# EAGLE design Rauchmelder_v3.9.1 (EAGLE 9.6.2)
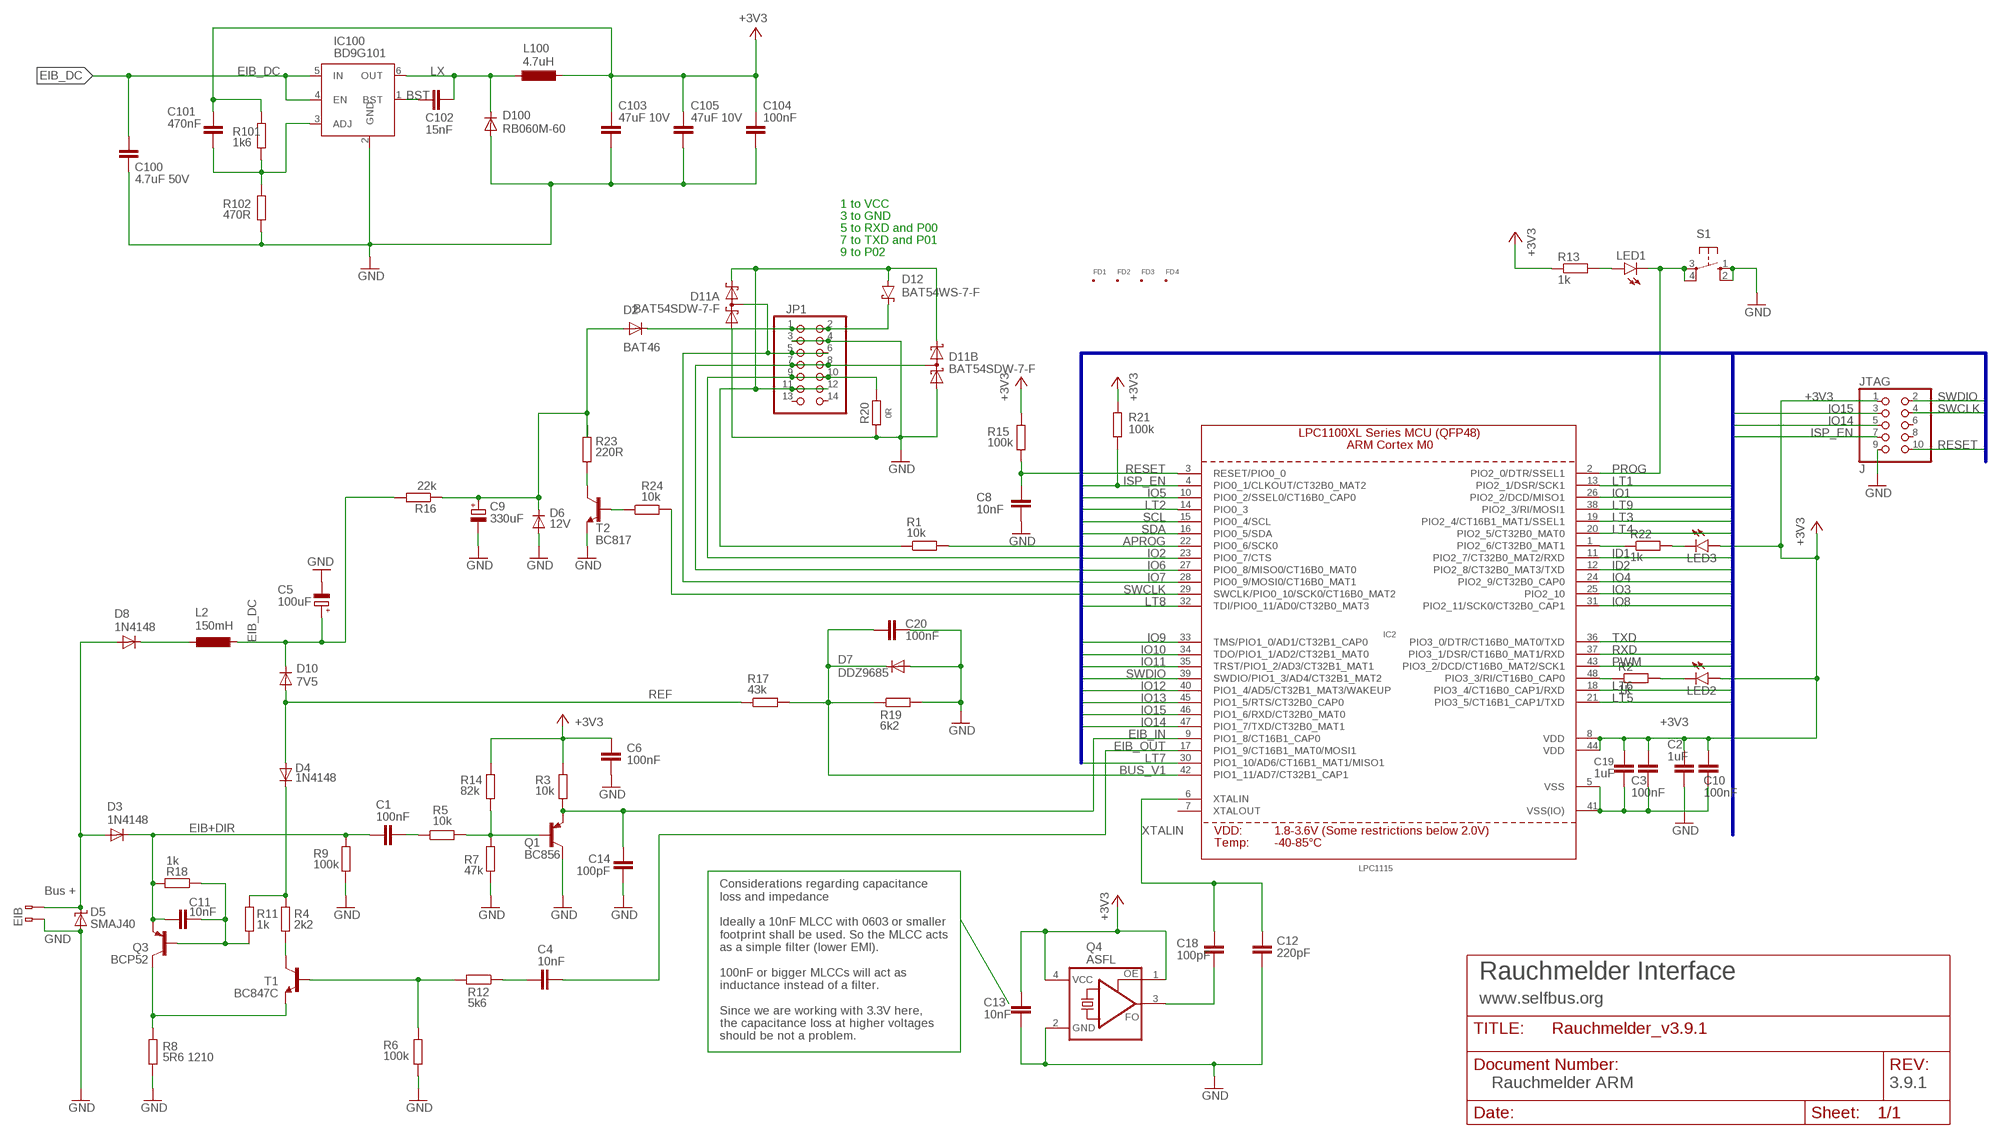
[diagram p0: schematic, sheet 1]

## Parts
C1  100nF  C-EUC0805  [C0805]
C2  1uF  C-EUC0805  [C0805]
C3  100nF  C-EUC0805  [C0805]
C4  10nF  C-EUC0805  [C0805]
C5  100uF  CPOL-EUSANYO_SMD_C6  [SANYO-OSCON_SMD_C6]
C6  100nF  C-EUC0805  [C0805]
C8  10nF  C-EUC0805  [C0805]
C9  330uF  CPOL-EUE3.5-8  [E3,5-8]
C10  100nF  C-EUC0805  [C0805]
C11  10nF  C-EUC0805  [C0805]
C12  220pF  C-EUC0805  [C0805]
C13  10nF  C-EUC0805  [C0805]
C14  100pF  C-EUC0805  [C0805]
C18  100pF  C-EUC0805  [C0805]
C19  1uF  C-EUC0805  [C0805]
C20  100nF  C-EUC0805  [C0805]
C100  4.7uF 50V  C-EUC1210  [C1210]
C101  470nF  C-EUC0805  [C0805]
C102  15nF  C-EUC0805  [C0805]
C103  47uF 10V  C-EUC0805  [C0805]
C104  100nF  C-EUC0805  [C0805]
C105  47uF 10V  C-EUC0805  [C0805]
D2  BAT46  DIODESOD-123  [SOD-123]
D3  1N4148  DIODESOD-123  [SOD-123]
D4  1N4148  DIODESOD-123  [SOD-123]
D5  SMAJ40  SUPPRESSOR-SMBJ  [SMBJ]
D6  12V  DIODESOD-123  [SOD-123]
D7  DDZ9685  DIODESOD-123  [SOD-123]
D8  1N4148  DIODESOD-123  [SOD-123]
D10  7V5  DIODESOD-123  [SOD-123]
D11  BAT54SDW-7-F  [SOT363]
D12  BAT54WS-7-F  [SOD323]
D100  RB060M-60  DIODESOD-123  [SOD-123]
FD1  FID_40MIL  [FID_040]
FD2  FID_40MIL  [FID_040]
FD3  FID_40MIL  [FID_040]
FD4  FID_40MIL  [FID_040]
IC2  LPC1115  LPC1113/4/5_QFP48_XLSERIES  [LQFP48]
IC100  BD9G101  BD9G101GBD9G101G-SOT23-6  [SOT23-6]
JP1  PINHD-2X7  [2X07]
JTAG  J  PINHD-2X05_2.00  [2X05M]
L2  150mH  150MH-L11PL1  [11P-L1]
L100  4.7uH  L-EUL4532P  [L4532P]
LED1  LEDCHIPLED_0805  [CHIPLED_0805]
LED2  LEDCHIPLED_0805  [CHIPLED_0805]
LED3  LEDCHIPLED_0805  [CHIPLED_0805]
Q1  BC856  BC856ALT1SMD  [SOT23-BEC]
Q3  BCP52  FZT753SMD  [SOT223]
Q4  ASFL  [ASF]
R1  10k  R-EU_R0805  [R0805]
R2  1k  R-EU_R0805  [R0805]
R3  10k  R-EU_R0805  [R0805]
R4  2k2  R-EU_R0805  [R0805]
R5  10k  R-EU_R0805  [R0805]
R6  100k  R-EU_R0805  [R0805]
R7  47k  R-EU_R0805  [R0805]
R8  5R6 1210  R-EU_R1210  [R1210]
R9  100k  R-EU_R0805  [R0805]
R11  1k  R-EU_R0805  [R0805]
R12  5k6  R-EU_R0805  [R0805]
R13  1k  R-EU_R0805  [R0805]
R14  82k  R-EU_R0805  [R0805]
R15  100k  R-EU_R0805  [R0805]
R16  22k  R-EU_R0805  [R0805]
R17  43k  R-EU_R0805  [R0805]
R18  1k  R-EU_R0805  [R0805]
R19  6k2  R-EU_R0805  [R0805]
R20  0R  R-EU_R0805  [R0805]
R21  100k  R-EU_R0805  [R0805]
R22  1k  R-EU_R0805  [R0805]
R23  220R  R-EU_R2512  [R2512]
R24  10k  R-EU_R0805  [R0805]
R101  1k6  R-EU_R0805  [R0805]
R102  470R  R-EU_R0805  [R0805]
S1  10-XX  [B3F-10XX]
T1  BC847C  [SOT23]
T2  BC817  TRANSISTOR_NPNWIDE  [SOT23-WIDE]
U$1  EIB  [BUSKLEMME243-724]

## Nets
+3V3: C2.2 C3.2 C6.2 C10.2 C13.2 C19.2 C101.2 C103.1 C104.1 C105.1 IC2.8(VDD) IC2.44(VDD) JTAG.1 L100.2 LED2.A LED3.A Q4.1(OE) Q4.4(VCC) R3.2 R13.1 R14.2 R15.1 R21.2 R101.2
APROG: IC2.22(PIO0_6/SCK0)
ARMINFO1: IC2.48(PIO3_3/RI/CT16B0_CAP0) R2.1
ARMINFO2: IC2.1(PIO2_6/CT32B0_MAT1) R22.1
BST: C102.2 IC100.1(BST)
BUS_V1: C20.2 D7.C IC2.42(PIO1_11/AD7/CT32B1_CAP1) R17.2 R19.1
EIB+: D3.A D5.C D8.A U$1.2(B-2)
EIB+DIR: C1.1 C11.1 D3.C Q3.3(E) R9.2 R18.2
EIB_DC: C5.+ C100.2 D10.C IC100.4(EN) IC100.5(IN) L2.2 R16.2
EIB_IN: C14.2 IC2.9(PIO1_8/CT16B1_CAP0) Q1.E R3.1
EIB_OUT: C4.2 IC2.17(PIO1_9/CT16B1_MAT0/MOSI1)
FB1: C101.1 IC100.3(ADJ) R101.1 R102.2
GND: C2.1 C3.1 C5.- C6.1 C8.1 C9.- C10.1 C12.1 C13.1 C14.1 C19.1 C20.1 C100.1 C103.2 C104.2 C105.2 D5.A D6.A D7.A D11.1(A:A) D11.4(B:A) D100.A IC2.5(VSS) IC2.41(VSS(IO)) IC100.2(GND) JP1.3 JP1.4 JTAG.9 Q1.C Q4.2(GND) R6.1 R7.1 R8.1 R9.1 R19.2 R20.1 R102.1 S1.1(S) S1.2(S1) T2.2(E) U$1.1(B-1)
ID1: IC2.11(PIO2_7/CT32B0_MAT2/RXD)
ID2: IC2.12(PIO2_8/CT32B0_MAT3/TXD)
IO1: IC2.26(PIO2_2/DCD/MISO1)
IO2: IC2.23(PIO0_7/CTS)
IO3: IC2.25(PIO2_10)
IO4: IC2.24(PIO2_9/CT32B0_CAP0)
IO5: IC2.10(PIO0_2/SSEL0/CT16B0_CAP0)
IO6: IC2.27(PIO0_8/MISO0/CT16B0_MAT0)
IO7: IC2.28(PIO0_9/MOSI0/CT16B0_MAT1)
IO8: IC2.31(PIO2_11/SCK0/CT32B0_CAP1)
IO9: IC2.33(TMS/PIO1_0/AD1/CT32B1_CAP0)
IO10: IC2.34(TDO/PIO1_1/AD2/CT32B1_MAT0)
IO11: IC2.35(TRST/PIO1_2/AD3/CT32B1_MAT1)
IO12: IC2.40(PIO1_4/AD5/CT32B1_MAT3/WAKEUP)
IO13: IC2.45(PIO1_5/RTS/CT32B0_CAP0)
IO14: IC2.47(PIO1_7/TXD/CT32B0_MAT1) JTAG.5
IO15: IC2.46(PIO1_6/RXD/CT32B0_MAT0) JTAG.3
ISP_EN: IC2.4(PIO0_1/CLKOUT/CT32B0_MAT2) JTAG.7 R21.1
LT1: IC2.13(PIO2_1/DSR/SCK1) R24.2
LT2: IC2.14(PIO0_3)
LT3: IC2.19(PIO2_4/CT16B1_MAT1/SSEL1)
LT4: IC2.20(PIO2_5/CT32B0_MAT0)
LT5: IC2.21(PIO3_5/CT16B1_CAP1/TXD) JP1.9 JP1.10 R20.2
LT6: IC2.18(PIO3_4/CT16B0_CAP1/RXD)
LT7: IC2.30(PIO1_10/AD6/CT16B1_MAT1/MISO1)
LT8: IC2.32(TDI/PIO0_11/AD0/CT32B0_MAT3) R1.2
LT9: IC2.38(PIO2_3/RI/MOSI1)
LX: C102.1 D100.C IC100.6(OUT) L100.1
N$1: D11.2(A:C) D11.5(B:C) D12.A JP1.11 JP1.12 R1.1
N$2: Q1.B R5.2 R7.2 R14.1
N$3: LED3.C R22.2
N$4: C11.2 Q3.1(B) R11.1 R18.1
N$5: LED2.C R2.2
N$7: R23.2 T2.3(C)
N$8: R24.1 T2.1(B)
N$9: LED1.A R13.2
N$10: C9.+ D2.A D6.C R16.1 R23.1
N$13: D8.C L2.1
N$16: C1.2 R5.1
N$18: D2.C D12.C JP1.1 JP1.2
N$22: C4.1 R12.1
N$23: R4.1 T1.3(C)
N$25: D4.C R4.2 R11.2
N$26: Q3.2(C) Q3.4(C) R8.2 T1.2(E)
N$34: R6.2 R12.2 T1.1(B)
N$35: C18.1 Q4.3(FO)
PROG: IC2.2(PIO2_0/DTR/SSEL1) LED1.C S1.3(P) S1.4(P1)
PWM: IC2.43(PIO3_2/DCD/CT16B0_MAT2/SCK1)
REF: D4.A D10.A R17.1
RESET: C8.2 IC2.3(RESET/PIO0_0) JTAG.10 R15.2
RXD: D11.6(A:AC) IC2.37(PIO3_1/DSR/CT16B0_MAT1/RXD) JP1.5 JP1.6
SCL: IC2.15(PIO0_4/SCL)
SDA: IC2.16(PIO0_5/SDA)
SWCLK: IC2.29(SWCLK/PIO0_10/SCK0/CT16B0_MAT2) JTAG.4
SWDIO: IC2.39(SWDIO/PIO1_3/AD4/CT32B1_MAT2) JTAG.2
TXD: D11.3(B:AC) IC2.36(PIO3_0/DTR/CT16B0_MAT0/TXD) JP1.7 JP1.8
XTALIN: C12.2 C18.2 IC2.6(XTALIN)
Unconnected: IC2.7(XTALOUT) JP1.13 JP1.14 JTAG.6 JTAG.8

## Buses
IO[1..15],LT[1..9],SCL,SDA,PWM,APROG,RXD,TXD,RESET,SWCLK,SWDIO,ISP_EN,ID1,ID2

## Notes on the sheet
- 1 to VCC
- 3 to GND
- 5 to RXD and P00
- 7 to TXD and P01
- 9 to P02
- Bus +
- GND
- Rauchmelder Interface
- www.selfbus.org
- Considerations regarding capacitance 
  loss and impedance 
  
  Ideally a 10nF MLCC with 0603 or smaller
  footprint shall be used. So the MLCC acts 
  as a simple filter (lower EMI). 
  
  100nF or bigger MLCCs will act as 
  inductance instead of a filter.  
  
  Since we are working with 3.3V here, 
  the capacitance loss at higher voltages
  should be not a problem.
- Rauchmelder ARM | 3.9.1

## Library data of the parts
C1-C4 C6 C8 C10-C14 C18-C20 C100-C105 = rcl:C-EU: CAPACITOR, European symbol; SPICEPREFIX: C
C5 C9 = rcl:CPOL-EU: POLARIZED CAPACITOR, European symbol; SPICEPREFIX: C
D2-D4 D6 D8 D10 = microbuilder:DIODE: Diode SMA Model Volts Amps Type Vf Vr Digikey # Notes SSA34-E3 40V 3A Schottky 480mV @ 3A 200uA @ 40V SSA34-E3/61TGITR-ND CDBA120-G 20V 1A Schottky 500mV @ 1A 500uA @ 20V 641-1014-6-ND REEL MBRA210 10V 2A Schottky 350mV @ 2A 700uA @ 10V MBRA210LT3 SOD-123 Model Volts Amps Type Vf Vr Order # Notes BAT54T1G 30V 200mA Schottky 800mV @ 200mA 2uA @ 25V BAT54T1GOSTR-ND B0530W 30V 500mA Schottky 430mV @ 500mA 130uA @ 30V B0530W-FDICT-ND REEL MBR120 1A 20V Schottky 340mV @ 1A MBR120VLSFT1GOSCT-ND SOD-323 Model Volts Amps Type Vf Vr Order # Notes PMEG2005EJ 20V 500mA Schottky 355mV @ 500mA 568-4110-1-ND ZLLS410 10V 570mA Schottky 380mV @ 570mA ZLLS410CT-ND 1N4148WS 75V 150mA Silicon/Simple 1V 1N4148WSFSCT-ND REEL SOD-523 Model Volts Amps Type Vf Vr Order # Notes BAT54XV2 30V 200mA Schottky 0.8V @ 100mA BAT54XV2CT-ND TB751S 30V 30mA Schottky RB751S-40TE61CT-ND SOT23-R/W (R = Solder Paste/Reflow Ovens, W = Hand-Soldering) Model Volts Amps Type Vf Vr Order # Notes BAT54FILM 40V 300mA Schottky 497-7162-1-ND
D5 = diode:SUPPRESSOR-: Suppressor diode
D7 = microbuilder:DIODE: Diode SMA Model Volts Amps Type Vf Vr Digikey # Notes SSA34-E3 40V 3A Schottky 480mV @ 3A 200uA @ 40V SSA34-E3/61TGITR-ND CDBA120-G 20V 1A Schottky 500mV @ 1A 500uA @ 20V 641-1014-6-ND REEL MBRA210 10V 2A Schottky 350mV @ 2A 700uA @ 10V MBRA210LT3 SOD-123 Model Volts Amps Type Vf Vr Order # Notes BAT54T1G 30V 200mA Schottky 800mV @ 200mA 2uA @ 25V BAT54T1GOSTR-ND B0530W 30V 500mA Schottky 430mV @ 500mA 130uA @ 30V B0530W-FDICT-ND REEL MBR120 1A 20V Schottky 340mV @ 1A MBR120VLSFT1GOSCT-ND SOD-323 Model Volts Amps Type Vf Vr Order # Notes PMEG2005EJ 20V 500mA Schottky 355mV @ 500mA 568-4110-1-ND ZLLS410 10V 570mA Schottky 380mV @ 570mA ZLLS410CT-ND 1N4148WS 75V 150mA Silicon/Simple 1V 1N4148WSFSCT-ND REEL SOD-523 Model Volts Amps Type Vf Vr Order # Notes BAT54XV2 30V 200mA Schottky 0.8V @ 100mA BAT54XV2CT-ND TB751S 30V 30mA Schottky RB751S-40TE61CT-ND SOT23-R/W (R = Solder Paste/Reflow Ovens, W = Hand-Soldering) Model Volts Amps Type Vf Vr Order # Notes BAT54FILM 40V 300mA Schottky 497-7162-1-ND; ALTERNATIVE: MMSZ4684T1G
D11 = MyDiode:BAT54SDW-7-F: SURFACE MOUNT SCHOTTKY BARRIER DIODE ARRAY 2 dual schottky diodes, in series Datasheet <https://www.diodes.com/assets/Datasheets/ds30152.pdf>
D12 = MyDiode:BAT54WS: SURFACE MOUNT SCHOTTKY BARRIER DIODE https://www.diodes.com/assets/Datasheets/BAT54WS.pdf
D100 = SamacSys_Parts:DIODE: Diode SMA Model Volts Amps Type Vf Vr Digikey # Notes SSA34-E3 40V 3A Schottky 480mV @ 3A 200uA @ 40V SSA34-E3/61TGITR-ND CDBA120-G 20V 1A Schottky 500mV @ 1A 500uA @ 20V 641-1014-6-ND REEL MBRA210 10V 2A Schottky 350mV @ 2A 700uA @ 10V MBRA210LT3 SOD-123 Model Volts Amps Type Vf Vr Order # Notes BAT54T1G 30V 200mA Schottky 800mV @ 200mA 2uA @ 25V BAT54T1GOSTR-ND B0530W 30V 500mA Schottky 430mV @ 500mA 130uA @ 30V B0530W-FDICT-ND REEL MBR120 1A 20V Schottky 340mV @ 1A MBR120VLSFT1GOSCT-ND SOD-323 Model Volts Amps Type Vf Vr Order # Notes PMEG2005EJ 20V 500mA Schottky 355mV @ 500mA 568-4110-1-ND ZLLS410 10V 570mA Schottky 380mV @ 570mA ZLLS410CT-ND 1N4148WS 75V 150mA Silicon/Simple 1V 1N4148WSFSCT-ND REEL SOD-523 Model Volts Amps Type Vf Vr Order # Notes BAT54XV2 30V 200mA Schottky 0.8V @ 100mA BAT54XV2CT-ND TB751S 30V 30mA Schottky RB751S-40TE61CT-ND SOT23-R/W (R = Solder Paste/Reflow Ovens, W = Hand-Soldering) Model Volts Amps Type Vf Vr Order # Notes BAT54FILM 40V 300mA Schottky 497-7162-1-ND
FD1-FD4 = Fiducial:FID: Fiducial marks. Top and Bottom copper with stop mask
IC2 = microbuilder:LPC1113/4/5_QFP48_XLSERIES: LPC1113/4/5 ARM Cortex M0 MCU (50MHz) - XL Series (FBD48/3x3) LPC1115FBD48/303: Max Frequency: 50MHz Flash: 64kB SRAM: 8kB ADC: 10-bit
IC100 = Stefan_selfbus:BD9G101G
JP1 = pinhead:PINHD-2X7: PIN HEADER
JTAG = pinhead-2:PINHD-2X05: PIN HEADER
L2 = RCL_for_Selfbus-Projects:150MH-L11P
L100 = rcl_changed:L-EU: INDUCTOR, European symbol; SPICEPREFIX: L
LED1-LED3 = led:LED: LED OSRAM: - CHIPLED LG R971, LG N971, LY N971, LG Q971, LY Q971, LO R971, LY R971 LH N974, LH R974 LS Q976, LO Q976, LY Q976 LO Q996 - Hyper CHIPLED LW Q18S LB Q993, LB Q99A, LB R99A - SideLED LS A670, LO A670, LY A670, LG A670, LP A670 LB A673, LV A673, LT A673, LW A673 LH A674 LY A675 LS A676, LA A676, LO A676, LY A676, LW A676 LS A679, LY A679, LG A679 - Hyper Micro SIDELED® LS Y876, LA Y876, LO Y876, LY Y876 LT Y87S - SmartLED LW L88C, LW L88S LB L89C, LB L89S, LG L890 LS L89K, LO L89K, LY L89K LS L896, LA L896, LO L896, LY L896 - TOPLED LS T670, LO T670, LY T670, LG T670, LP T670 LSG T670, LSP T670, LSY T670, LOP T670, LYG T670 LG T671, LOG T671, LSG T671 LB T673, LV T673, LT T673, LW T673 LH T674 LS T676, LA T676, LO T676, LY T676, LB T676, LH T676, LSB T676, LW T676 LB T67C, LV T67C, LT T67C, LS T67K, LO T67K, LY T67K, LW E67C LS E67B, LA E67B, LO E67B, LY E67B, LB E67C, LV E67C, LT E67C LW T67C LS T679, LY T679, LG T679 LS T770, LO T770, LY T770, LG T770, LP T770 LB T773, LV T773, LT T773, LW T773 LH T774 LS E675, LA E675, LY E675, LS T675 LS T776, LA T776, LO T776, LY T776, LB T776 LHGB T686 LT T68C, LB T68C - Hyper Mini TOPLED® LB M676 - Mini TOPLED Santana® LG M470 LS M47K, LO M47K, LY M47K Source: http://www.osram.convergy.de LUXEON: - LUMILED® LXK2-PW12-R00, LXK2-PW12-S00, LXK2-PW14-U00, LXK2-PW14-V00 LXK2-PM12-R00, LXK2-PM12-S00, LXK2-PM14-U00 LXK2-PE12-Q00, LXK2-PE12-R00, LXK2-PE12-S00, LXK2-PE14-T00, LXK2-PE14-U00 LXK2-PB12-K00, LXK2-PB12-L00, LXK2-PB12-M00, LXK2-PB14-N00, LXK2-PB14-P00, LXK2-PB14-Q00 LXK2-PR12-L00, LXK2-PR12-M00, LXK2-PR14-Q00, LXK2-PR14-R00 LXK2-PD12-Q00, LXK2-PD12-R00, LXK2-PD12-S00 LXK2-PH12-R00, LXK2-PH12-S00 LXK2-PL12-P00, LXK2-PL12-Q00, LXK2-PL12-R00 Source: www.luxeon.com KINGBRIGHT: KA-3528ASYC Source: www.kingbright.com
Q1 = transistor-pnp:BC856*: PNP Transistror
Q3 = transistor-pnp:FZT753SMD: PNP Transistor
Q4 = crystal:ASF*: CRYSTAL CLOCK OSCILLATORS 5.0 Vdc or 3.3 Vdc - LOW PROFILE ULTRA MINIATURE CERAMIC SURFACE MOUNT Source: http://www.abracon.com/Oscillators/asf1-L-L1.pdf; MPN: ASFLM1-50.000MHZ-C-T; OC_FARNELL: 1838931; OC_NEWARK: 99M0411
R1-R9 R11-R19 R21-R24 R101 R102 = rcl:R-EU_: RESISTOR, European symbol; SPICEPREFIX: R
R20 = MyRCL:R-EU_: RESISTOR, European symbol
S1 = switch-omron:10-XX: OMRON SWITCH
T1 = transistor:BC847C: NPN TRANSISTOR
T2 = microbuilder:TRANSISTOR_NPN: NPN Transistor Transistor (NPN) 500mA 45V - BC817 [Digikey: 568-1631-1-ND] Transistor (NPN) 500mA 45V - BC817,215 [Mouser: 771-BC817-T/R] SOT23-R - SOT23 footprint optimised for use with solder paste and reflow ovens. SOT23-W - SOT23 footprint optimised for hand-soldering (larger pads).
U$1 = con-wago:EIB

## Board
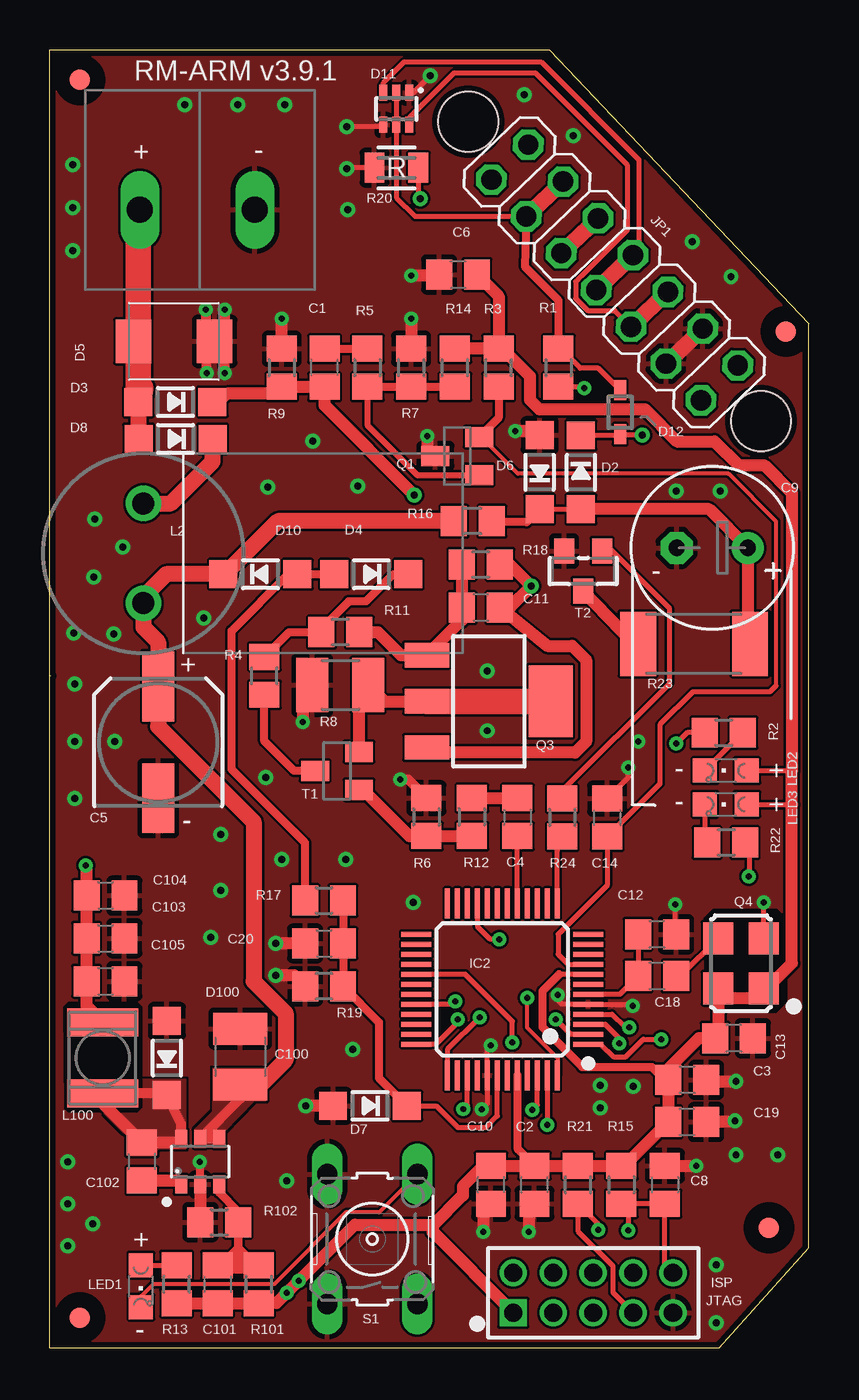
[diagram p1: board, top side]
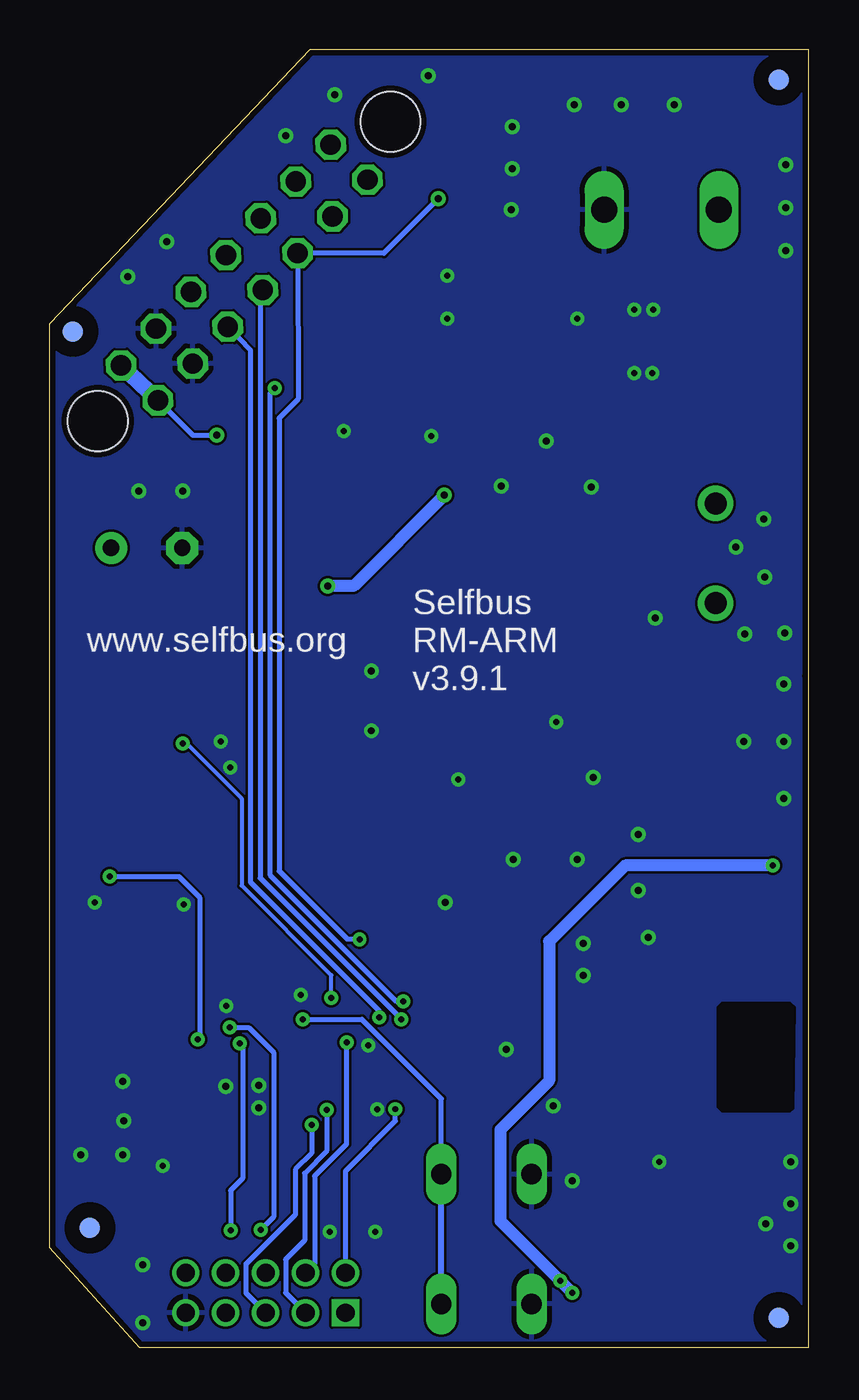
[diagram p2: board, bottom side, seen from below]

Size 38 x 65 mm. Coordinates in mm from the lower left corner, seen from the top.
Outline: 0,33.66 0.04,33.66
Outline: 0,0 0,65 25,65 38,51.3 38,5 33.5,0 0,0
Copper layers (1*16): Top 0.035mm / dielectric 1.5mm / Bottom 0.035mm
Design rules "aisler_2_layer_complex": minimum track width 0.125mm, minimum drill 0.2mm, track to track 0.125mm, track to pad 0.125mm, pad to pad 0.125mm, via to via 0.125mm, smd to smd 0.125mm, copper to edge 0.3mm, drill to drill 0.25mm, minimum pad ring 0.2mm, minimum via ring 0.2mm, stop-mask expansion 0mil, vias tented up to drill 0mil, thermal gap 10mil
Holes 3 mm at 20.95,61.4 35.6,46.4
tRestrict: area 32.7,16.8 to 36.9,21.9; area 0.7,11.8 to 4.6,17.3
bRestrict: area 0.7,11.8 to 4.6,17.3

### Footprints (pad centres in the part's own frame; a part is rotated, then mirrored left to right if it is on the bottom)
C0805 = smd 1.3 x 1.5: 1 -0.95,0; 2 0.95,0
SANYO-OSCON_SMD_C6 = smd 3.5 x 1.6: + 2.8,0; - -2.8,0
E3,5-8 = drill 0.813 pad 1.6: + -1.778,0 | drill 0.813 pad 1.6 octagon: - 1.778,0
C1210 = smd 1.6 x 2.7: 1 -1.4,0; 2 1.4,0
SOD-123 = smd 1.4 x 1.4: A 1.85,0; C -1.85,0
SMBJ = smd 1.78 x 2.16: A 2.04,0; C -2.03,0
SOT363 = smd 0.4 x 0.8: 1 -0.65,-0.8; 2 0,-0.8; 3 0.65,-0.8; 4 0.65,0.8; 5 0,0.8; 6 -0.65,0.8
SOD323 = smd 1 x 0.6: A 1.1,0; C -1.1,0
FID_040 = smd 1.016 x 1.016 bottom: FIDB 0,0 | smd 1.016 x 1.016: FIDT 0,0
LQFP48 = smd 1.5 x 0.25: 1 -4.3,2.75; 2 -4.3,2.25; 3 -4.3,1.75; 4 -4.3,1.25; 5 -4.3,0.75; 6 -4.3,0.25; 7 -4.3,-0.25; 8 -4.3,-0.75; 9 -4.3,-1.25; 10 -4.3,-1.75; 11 -4.3,-2.25; 12 -4.3,-2.75; 25 4.3,-2.75; 26 4.3,-2.25; 27 4.3,-1.75; 28 4.3,-1.25; 29 4.3,-0.75; 30 4.3,-0.25; 31 4.3,0.25; 32 4.3,0.75; 33 4.3,1.25; 34 4.3,1.75; 35 4.3,2.25; 36 4.3,2.75 | smd 0.25 x 1.5: 13 -2.75,-4.3; 14 -2.25,-4.3; 15 -1.75,-4.3; 16 -1.25,-4.3; 17 -0.75,-4.3; 18 -0.25,-4.3; 19 0.25,-4.3; 20 0.75,-4.3; 21 1.25,-4.3; 22 1.75,-4.3; 23 2.25,-4.3; 24 2.75,-4.3; 37 2.75,4.3; 38 2.25,4.3; 39 1.75,4.3; 40 1.25,4.3; 41 0.75,4.3; 42 0.25,4.3; 43 -0.25,4.3; 44 -0.75,4.3; 45 -1.25,4.3; 46 -1.75,4.3; 47 -2.25,4.3; 48 -2.75,4.3
SOT23-6 = smd 0.6 x 0.9: 1 -0.95,-1.15; 2 0,-1.15; 3 0.95,-1.15; 4 0.95,1.15; 5 0,1.15; 6 -0.95,1.15
2X07 = drill 1.016 octagon: 1 -7.62,-1.27; 2 -7.62,1.27; 3 -5.08,-1.27; 4 -5.08,1.27; 5 -2.54,-1.27; 6 -2.54,1.27; 7 0,-1.27; 8 0,1.27; 9 2.54,-1.27; 10 2.54,1.27; 11 5.08,-1.27; 12 5.08,1.27; 13 7.62,-1.27; 14 7.62,1.27
2X05M = drill 0.914 square: 1 -4,-1 | drill 0.914: 2 -4,1; 3 -2,-1; 4 -2,1; 5 0,-1; 6 0,1; 7 2,-1; 8 2,1; 9 4,-1; 10 4,1
11P-L1 = drill 1.1 pad 1.778: 1 -2.5,0; 2 2.5,0
L4532P = smd 1.397 x 3.556: 1 -1.778,0; 2 1.778,0
CHIPLED_0805 = smd 1.2 x 1.2: A 0,-1.05; C 0,1.05
SOT23-BEC = smd 1 x 1.4: B -0.95,-1.1; C 0,1.1; E 0.95,-1.1
SOT223 = smd 1.219 x 2.235: 1 -2.311,-3.099; 2 0,-3.099; 3 2.311,-3.099 | smd 3.6 x 2.2: 4 0,3.099
ASF = smd 1.6 x 1.5: 1 -1.25,-1.15; 2 1.25,-1.15; 3 1.25,1.15; 4 -1.25,1.15
R0805 = smd 1.3 x 1.5: 1 -0.95,0; 2 0.95,0
R1210 = smd 1.6 x 2.7: 1 -1.4,0; 2 1.4,0
R0805' = smd 1 x 1.5: 1 -1.1,0; 2 1.1,0
R2512 = smd 1.8 x 3.2: 1 -2.8,0; 2 2.8,0
B3F-10XX = drill 1.016 long: 1 -3.251,2.261; 2 3.251,2.261; 3 -3.251,-2.261; 4 3.251,-2.261
SOT23 = smd 1 x 1.4: 1 -0.95,-1.1; 2 0.95,-1.1; 3 0,1.1
SOT23-WIDE = smd 1 x 1.27: 1 -0.95,-1; 2 0.95,-1; 3 0,1
BUSKLEMME243-724 = drill 1.3 long: 1 -2.875,0; 2 2.875,0

### Placement (x,y rotation side)
C1  13.75,49.08 90 top
C2  24.26,8.16 90 top
C3  31.91,13.41 180 top
C4  23.4,26.57 270 top
C5  5.42,30.32 90 top
C6  20.43,53.75 0 top
C8  30.79,8.16 270 top
C9  33.16,40.06 180 top
C10  22.08,8.16 90 top
C11  21.58,37.06 180 top
C12  30.4,20.7 180 top
C13  34.25,15.5 180 top
C14  27.9,26.55 270 top
C18  30.4,18.61 180 top
C19  31.9,11.3 180 top
C20  13.72,20.25 0 top
C100  9.53,14.58 270 top
C101  8.4,3.18 270 top
C102  4.6,9.33 270 top
C103  2.78,20.5 0 top
C104  2.78,22.65 0 top
C105  2.78,18.35 0 top
D2  26.59,43.84 270 top
D3  6.28,47.37 180 top
D4  16.09,38.74 180 top
D5  6.21,50.4 0 top
D6  24.52,43.85 90 top
D7  16.02,12.11 180 top
D8  6.29,45.51 180 top
D10  10.53,38.74 0 top
D11  17.35,62.05 180 top
D12  28.55,46.85 90 top
D100  5.86,14.51 90 top
FD1  1.5,63.5 0 top
FD2  36,6 0 top
FD3  36.85,50.9 0 top
FD4  1.5,1.5 0 top
IC2  22.65,17.95 180 top
IC100  7.52,9.32 0 top
JP1  28.27,53.85 133.5 top
JTAG  27.2,2.75 0 top
L2  4.67,39.79 270 top
L100  2.65,14.51 90 top
LED1  4.55,3.08 180 top
LED2  33.84,28.9 90 top
LED3  33.84,27.21 90 top
Q1  20.39,44.66 90 top
Q3  21.97,32.38 270 top
Q4  34.6,19.25 90 top
R1  25.46,49.08 270 top
R2  33.74,30.8 0 top
R3  22.47,49.08 90 top
R4  10.73,33.65 90 top
R5  15.89,49.08 270 top
R6  18.85,26.57 270 top
R7  18.08,49.08 270 top
R8  14.53,33.19 0 top
R9  11.61,49.08 270 top
R11  14.54,35.84 180 top
R12  21.13,26.57 270 top
R13  6.34,3.18 90 top
R14  20.28,49.08 90 top
R15  28.62,8.16 270 top
R16  21.18,41.4 180 top
R17  13.72,22.39 0 top
R18  21.58,39.23 0 top
R19  13.72,18.1 180 top
R20  0R  [R0805']  17.35,59.1 0 top
R21  26.44,8.16 90 top
R22  33.86,25.3 180 top
R23  32.25,35.25 180 top
R24  25.65,26.55 270 top
R101  10.45,3.18 270 top
R102  8.48,6.28 0 top
S1  16.14,5.44 90 top
T1  14.38,28.89 90 top
T2  26.7,38.9 180 top
U$1  7.38,56.99 180 top

### Tracks (layer width: path | path; a pad name or v marks a point on that pad's centre or on a via)
+3V3  (via drill 0.3)
  Top 0.254: IC2.8 25.5,18.7 | 23.44,9.93 23.4,9.99 | LED2.A 37.15,28.9 | 37.15,27.2 37.14,27.21 LED3.A
  Top 0.406: IC2.44 23.4,9.99 | 23.44,9.93 C2.2 | C3.2 30.79,13.41 30.14,14.06 26.65,14.06 24.66,16.06 24.66,17.86 25.5,18.7
  Top 0.61: R13.1 C101.2 R101.2 10.47,2.24 11.35,2.24 v11.85,2.74 15.27,6.16 19.16,6.16 19.16,6.11 | 19.16,6.11 20.67,7.63 20.67,8.08 21.7,9.11 C10.2 C2.2 R21.2 R15.1 28.76,9.11 C19.2 C3.2 30.96,13.97 32.49,15.5 C13.2 33.45,15.65 Q4.4 33.95,17.5 35.25,17.5 Q4.1 35.9,18 37.15,19.25 37.15,27.2 37.15,28.9 37.15,42.8 35.76,44.2 34.48,44.2 33.28,45.39 31.4,45.39 29.79,47 24.51,47 24.03,47.48 24.03,48.66 22.65,50.03 R3.2 | 19.16,6.11 19.16,5.79 JTAG.1 | C6.2 22.47,52.66 R3.2 | L100.2 1.83,17.11 C105.1 C103.1 C104.1 1.83,24.12 v1.8,24.15 | R3.2 R14.2
  Bottom 0.61: v1.8,24.15 9.2,24.15 13,20.35 13,13.37 15.45,10.92 15.45,6.34 v12.45,3.34 v11.85,2.74
ARMINFO1  (via drill 0.3)
  Top 0.2: v23.91,17.51 23.91,16.01 25.43,14.49 25.43,13.68 IC2.48
  Top 0.254: R2.1 31.9,30.8 v31.35,30.25
  Bottom 0.2: v23.91,17.51 23.91,18.65 28.4,23.14 28.4,27.5 31.25,30.35 v31.35,30.25
ARMINFO2  (via drill 0.3)
  Top 0.254: R22.1 35.01,25.1 v35.01,23.61 v35,23.6 | v30.6,15.45 29.72,15.45 28.83,14.57 28.22,14.57 27.58,15.2 IC2.1
  Bottom 0.254: v30.6,15.45 30.5,15.55 30.5,22.55 31.55,23.6 v35,23.6
BST
  Top 0.61: C102.2 6.36,8.38 IC100.1
BUS_V1
  Top 0.254: IC2.42 22.4,11.6 21.82,11.02 20.43,11.02 19.34,12.11 D7.C
  Top 0.406: R17.2 C20.2 R19.1 16.47,16.3 16.47,13.51 D7.C
EIB+
  Top 0.813: D8.A 4.44,47.36 D3.A
  Top 1.27: U$1.2 4.43,56.91 4.43,50.65 D5.C 4.43,50.15 4.43,48.17 4.55,48.05 D3.A
EIB+DIR  (via drill 0.35)
  Top 0.61: Q3.3 19.14,29.8 26.3,29.8 26.85,30.35 26.85,34.45 26.15,35.15 24.89,35.15 C11.1 23.03,37.06 24.1,38.13 v24.1,38.15 23.02,39.23 R18.2 | D3.C 8.44,47.37 8.85,47.78 11.26,47.78 R9.2 C1.1 13.75,47.2 v18.25,42.7
  Bottom 0.61: v18.25,42.7 22.8,38.15 v24.1,38.15
EIB_DC
  Top 0.508: IC100.4 IC100.5 9.53,12.48
  Top 0.813: R16.2 11.42,41.4 8.76,38.74 D10.C 5.82,38.74 4.67,37.59 L2.2 4.67,36.09 5.42,35.34 C5.+ 5.42,31.12 10.2,26.34 10.2,18.36 11.81,16.75 11.81,14.42 10.48,13.09 9.61,13.09 C100.2
  pour Top (no thermals): 8.15,14 8.15,11.8 7.25,10.9 7.25,10.05 8.7,10.05 8.7,10.8 10.2,12.35 10.8,12.35 10.8,14
EIB_IN
  Top 0.2: 36.35,33.15 36.35,41.4 33.98,43.77 23.43,43.77 21.59,45.61 Q1.E
  Top 0.254: IC2.9 25.95,19.2 25.45,19.7 25.45,20.7 27.9,23.15 C14.2 30.54,28.24 30.54,31.2 32.19,32.85 36.05,32.85 36.35,33.15
  Top 0.406: R3.1 22.47,46.58 Q1.E
EIB_OUT
  Top 0.254: IC2.17 23.4,25.17 C4.2
FB1
  Top 0.406: IC100.3 8.47,7.77 9.43,6.81 R102.2 | R101.1 10.3,4.13 9.43,5 R102.2 | R102.2 9.43,5.01 8.55,4.13 C101.1
  Top 1.016: C101.1 8.5,4.23 10.35,4.23 R101.1
GND  (via drill 0.3, 0.35)
  Top 0.152: 16.7,61.48 D11.4
  Top 0.254: v25.43,17.67 25.43,17.41 25.64,17.2 IC2.5 28.9,17.2 28.98,17.12 v29.18,17.12 | v21.62,11.94 21.9,12.23 IC2.41 21.9,14.98 v22.07,15.14 | C12.1 31.3,20.75 v31.3,22.2 | Q4.2 v35.75,22.3 | C14.1 28.97,28.57 v28.97,29.05 | R20.1 14.9,59.1 v14.85,59.05 | v19.05,63.7 18.2,62.85 D11.1 | D11.4 16.6,61.15 v14.85,61.15
  Top 0.406: IC100.2 7.52,9.28 v7.5,9.3
  Top 0.508: v17.55,28.45 17.95,28.45 18.4,28 R6.1 | D5.A 7.8,50.85 v7.8,52 | D5.A 8.75,50.91 v8.75,52 | v7.85,48.8 7.85,50.01 D5.A | v8.75,48.8 8.75,49.9 D5.A
  Top 0.61: IC100.2 7.52,6.74 R102.1 | C6.1 19.44,53.7 v18.1,53.7 | C20.1 v11.3,20.25 | R19.2 12.22,18.65 v11.3,18.65 | C3.1 33,13.35 v34.35,13.35 | v34.3,11.35 34.25,11.3 C19.1 | C8.1 31.25,9.1 v32.35,9.1 | C10.1 21.7,6.53 v21.7,5.8 | R8.1 12.65,32.73 v12.65,31.35 | v18.1,51.55 18.1,50.06 R7.1 | R9.1 11.6,50.07 v11.6,51.55 | D6.A 24.17,45.9 v23.3,45.9 | v18.9,45.65 18.9,45.05 Q1.C | C2.1 23.98,6.48 v23.98,5.8 | D7.A 12.81,12.11 v12.8,12.1
  Top 0.813: JP1.4 JP1.3
  other vias: 21.9,33.9 2.25,41.5 2.2,38.6 13.15,45.4 10.9,43.1 3.65,40.1 6.75,62.25 1.15,59.25 9.4,62.25 11.75,62.25 1.25,27.5 1.25,30.35 1.25,33.25 1.2,35.8 3.25,30.35 1.15,54.95 1.15,57.1 18.2,22.3 15.15,14.95 10.8,28.55 21.9,30.9 14.8,24.45 7.7,36.55 3.2,35.75 27.55,13.15 29.2,13.1 27.55,12 33.55,42.9 29.45,30.35 0.9,9.3 0.9,5.1 0.9,7.2 8.55,25.7 34.35,9.65 36.45,9.65 2.15,6.2 11.6,24.45 8.05,20.55 8.55,22.9 15.4,43.15 31.35,42.9 11.85,8.35 33.35,1.25 33.35,4.15 32.15,55.4 34.1,53.65 14.9,57 23.75,62.75 26.2,60.7
  pour Bottom (rank 2): 33.5,0 0,0 0,65 25,65 38,51.3 38,5
  pour Top (rank 2): 33.5,0 0,0 0,65 25,65 38,51.3 38,5
IO14  (via drill 0.3)
  Top 0.254: IC2.47 v24.9,11.15
  Bottom 0.254: v24.9,11.15 24.9,9.74 25.71,8.93 25.71,6.66 28.19,4.18 28.19,2.74 JTAG.5
IO15  (via drill 0.3)
  Top 0.254: v24.15,11.9 24.4,12.15 IC2.46
  Bottom 0.254: v24.15,11.9 24.15,9.85 25.25,8.74 25.25,5.37 26.2,4.42 26.2,2.75 JTAG.3
ISP_EN  (via drill 0.3)
  Top 0.254: IC2.4 28.13,16.7 28.8,16.03 v29,16.03 | v27.45,5.9 27.45,6.2 R21.1 26.44,5.84 28.19,4.09 28.19,2.76 JTAG.7
  Bottom 0.254: v29,16.03 28.05,16.03 26.8,14.79 26.8,6.55 v27.45,5.9
LT1
  Top 0.254: IC2.13 25.4,24.88 R24.2
LT5  (via drill 0.3, 0.35)
  Top 0.254: v22.5,20.45 22.05,20.45 21.4,21.1 IC2.21 | R20.2 18.45,57.65 v18.55,57.55
  Top 0.813: JP1.9 JP1.10
  Bottom 0.254: v22.5,20.45 23.1,20.45 26.53,23.88 26.53,46.55 25.58,47.5 JP1.10 21.28,54.82 v18.55,57.55
LT8  (via drill 0.3)
  Top 0.254: v20.3,17.35 20.15,17.2 IC2.32 | R1.2 26.66,48.13 v26.74,48.05
  Bottom 0.254: v26.74,48.05 26.99,47.8 26.99,23.69 20.65,17.35 v20.3,17.35
LX
  Top 0.508: IC100.6 6.57,11.22 D100.C 5.86,12.73 L100.1
  Top 0.61: L100.1 2.65,12.23 C102.1 6.38,10.28 IC100.6
  pour Top (no thermals): 4,9.6 5.2,9.6 arc90 5.35,9.75 5.35,9.85 arc-90 5.45,9.95 6.75,9.95 arc90 6.8,10 6.8,13.45 1,13.45 arc90 0.85,13.3 0.85,12.15 arc90 1,12 2.45,12 arc-90 2.55,11.9 3.7,10.75 arc-90 3.85,10.6 3.85,9.75 arc90
N$1
  Top 0.254: D11.2 D11.5 17.35,57.6 18.29,56.66 JP1.12 | D12.A 27.45,49.05 26.54,49.05 25.56,50.03 R1.1
  Top 0.406: R1.1 25.46,52.46 23.78,54.14 JP1.12
  Top 0.813: JP1.11 JP1.12
N$2
  Top 0.305: R5.2 15.89,46.21 18.4,43.7 Q1.B
  Top 0.406: R5.2 R7.2 R14.1
N$3
  Top 0.254: LED3.C 32.79,25.42 R22.2
N$4
  Top 0.61: R11.1 16.42,35.84 17.57,34.69 Q3.1 20.63,36.44 C11.2 R18.1
N$5
  Top 0.254: LED2.C R2.2
N$7
  Top 0.61: R23.2 29.25,35.25 T2.3
N$8
  Top 0.254: R24.1 25.65,27.9 31,33.25 31,37.05 28.05,40 T2.1
N$9
  Top 0.254: LED1.A R13.2
N$10
  Top 0.254: D6.C D2.A
  Top 0.406: R16.1 22.18,41.35 23.86,41.35 D6.C
  Top 0.61: D2.A 33,41.99 C9.+ 34.94,35.36 R23.1
N$13
  Top 0.813: L2.1 6.04,42.29 8.14,44.39 D8.C
N$16
  Top 0.406: C1.2 R5.1
N$18  (via drill 0.35)
  Top 0.254: v29.65,45.7 28.6,45.7 D12.C 28.5,45.7 D2.C
  Bottom 0.254: JP1.2 30.85,45.7 v29.65,45.7
  Bottom 0.813: JP1.2 JP1.1
N$22
  Top 0.61: R12.1 C4.1
N$23
  Top 0.406: T1.3 12.23,28.89 10.73,30.39 R4.1
N$25
  Top 0.406: D4.C 17.19,38.74 15.83,37.37 14.96,37.37 13.43,35.84 | R11.2 13.43,35.84 | R4.2 11.97,35.84 13.43,35.84
N$26
  Top 0.61: T1.2 15.48,32.73 R8.2 16.74,32.38 Q3.2
  Top 1.27: Q3.2 Q3.4
N$34
  Top 0.61: R12.2 R6.2 17.99,25.62 15.58,28.04 T1.1
N$35
  Top 0.254: Q4.3 31.56,18.61 C18.1
PROG  (via drill 0.3)
  Top 0.2: 4.55,2.55 5.18,3.18 11.23,3.18 14.82,6.77 16.48,6.77 S1.4
  Top 0.254: IC2.2 26.08,15.7 v25.33,16.45 | 4.55,2.55 LED1.C
  Bottom 0.254: v25.33,16.45 22.38,16.45 18.4,12.47 S1.4
  Bottom 0.305: S1.3 S1.4
REF
  Top 0.406: D4.A D10.A 11.93,38.74 9.1,35.9 9.1,28.96 12.77,25.29 R17.1
RESET  (via drill 0.3)
  Top 0.254: IC2.3 27.8,16.2 28.5,15.5 v28.5,15.25 | JTAG.10 30.79,4.16 C8.2 R15.2 28.95,6.87 v28.95,5.87
  Bottom 0.254: v28.5,15.25 28.35,15.1 28.35,8.47 28.95,7.87 v28.95,5.87
RXD  (via drill 0.3)
  Top 0.254: v21.52,16.55 19.9,14.93 IC2.37 | JP1.6 28.28,51.95 26.92,51.95 26.32,52.55 26.32,53.4 26.58,53.66 26.6,53.66 28.9,55.96 28.9,59.25 24.3,63.85 20.25,63.85 18,61.6 D11.6
  Top 0.813: JP1.5 JP1.6
  Bottom 0.254: JP1.6 27.97,49.96 27.97,23.32 21.52,16.87 v21.52,16.55
SWCLK  (via drill 0.3)
  Top 0.254: v23.15,15.3 23.15,16.35 20.8,18.7 IC2.29
  Bottom 0.254: JTAG.4 24.75,4.2 24.75,8.6 23.15,10.2 v23.15,15.3
SWDIO  (via drill 0.3)
  Top 0.254: v20.7,11.95 20.9,12.15 IC2.39
  Bottom 0.254: JTAG.2 23.2,8.85 20.7,11.35 v20.7,11.95
TXD  (via drill 0.3)
  Top 0.254: v20.41,16.44 20.41,16.3 19.31,15.2 IC2.36 | D11.3 16.7,63.36 17.75,64.4 24.6,64.4 29.49,59.51 29.49,55.02 JP1.7
  Top 0.813: JP1.7 JP1.8
  Bottom 0.254: JP1.8 27.47,52.85 27.47,23.52 20.41,16.46 v20.41,16.44
XTALIN
  Top 0.254: IC2.6 28.54,17.7 C18.2 C12.2

### Text on the board
tPlace: RM-ARM v3.9.1 | + | - | - | + | - | + | - | + | - | + | -
bPlace: www.selfbus.org | Selfbus / RM-ARM / v3.9.1
tNames: ISP